# Altium schematic sheet breakout.SchDoc: Pin Breakout
size A4; SheetNumber: 6; SheetTotal: 6
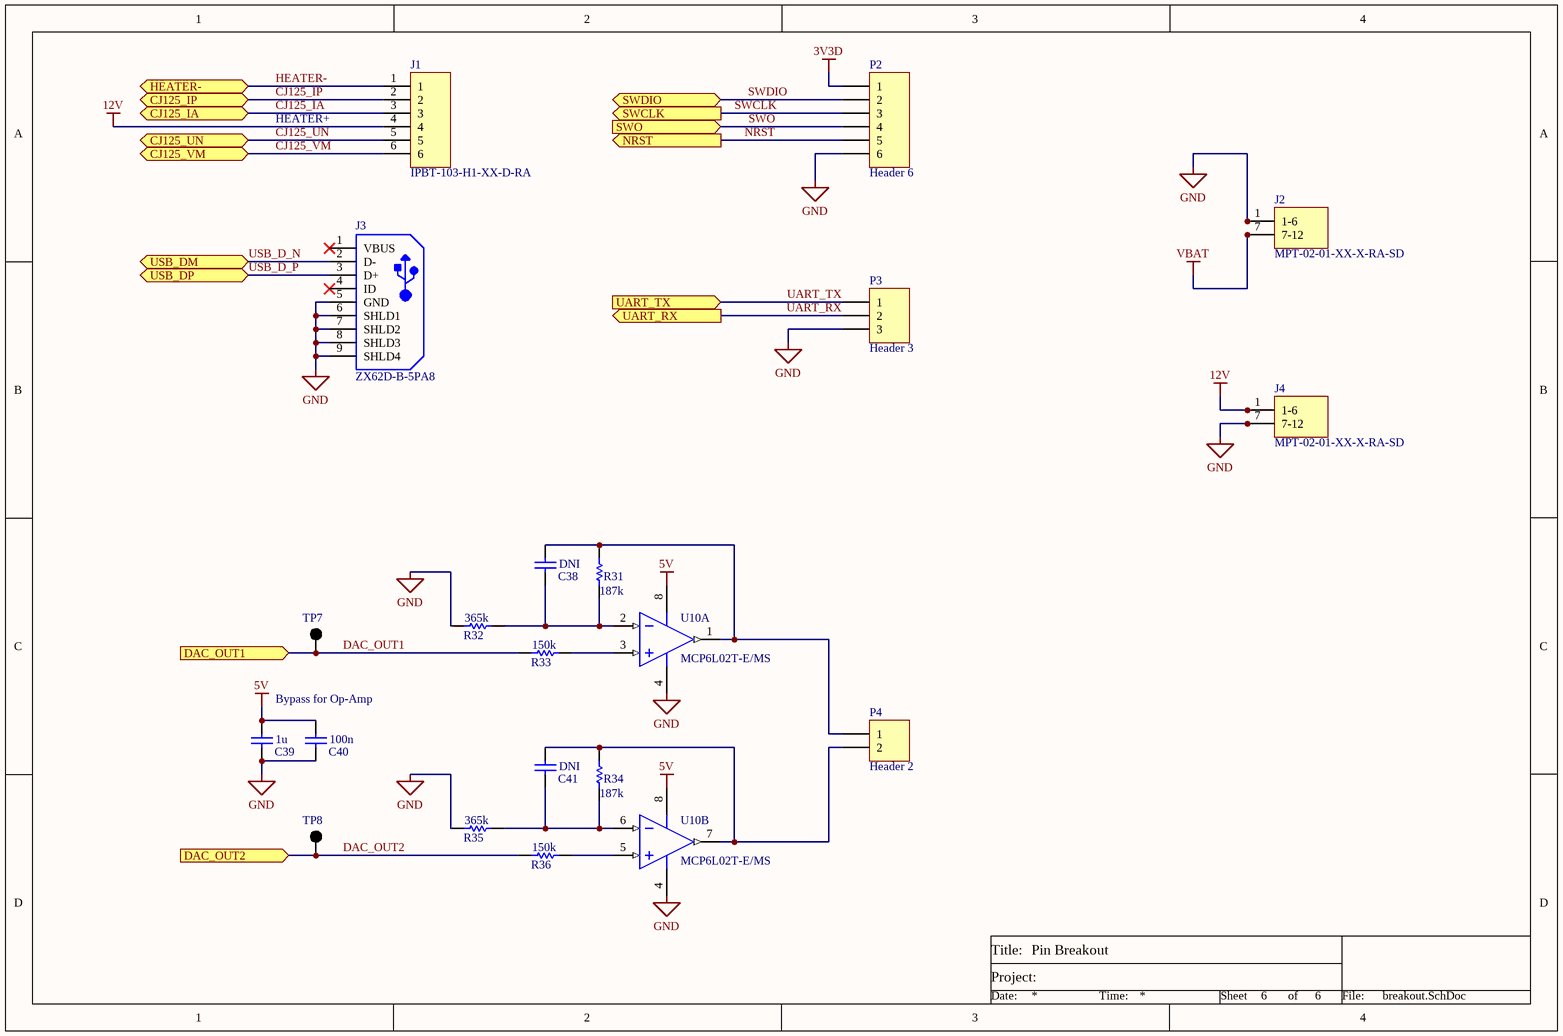
[diagram p0: breakout.SchDoc]

## Parts
C38  value DNI  [0805]  (hidden comment: Generic 0805 Capacitor)
C39  value 1u  [0805]  (hidden comment: Generic 0805 Capacitor)
C40  value 100n  [0805]  (hidden comment: Generic 0805 Capacitor)
C41  value DNI  [0805]  (hidden comment: Generic 0805 Capacitor)
J1  IPBT-103-H1-XX-D-RA  [IPBT-103-H1-XX-D-RA]
J2  MPT-02-01-XX-X-RA-SD  [MPT-02-01-XX-X-RA-SD]
J3  ZX62D-B-5PA8  [HIRO-ZX62D-B-5PA8_V]
J4  MPT-02-01-XX-X-RA-SD  [MPT-02-01-XX-X-RA-SD]
P2  Header 6  [HDR1X6]
P3  Header 3  [HDR1X3]
P4  Header 2  [HDR1X2]
R31  value 187k  [0603]  (hidden comment: Generic 0603 Resistor)
R32  value 365k  [0603]  (hidden comment: Generic 0603 Resistor)
R33  value 150k  [0603]  (hidden comment: Generic 0603 Resistor)
R34  value 187k  [0603]  (hidden comment: Generic 0603 Resistor)
R35  value 365k  [0603]  (hidden comment: Generic 0603 Resistor)
R36  value 150k  [0603]  (hidden comment: Generic 0603 Resistor)
TP7  5001  [KSTN-5001]  (value not drawn)
TP8  5001  [KSTN-5001]  (value not drawn)
U10  MCP6L02T-E/MS  [MSOP8_M]  (parts A,B of 2)

## Ports
CJ125_IA (bidir), CJ125_IP (bidir), CJ125_UN (bidir), CJ125_VM (bidir), DAC_OUT1 (in), DAC_OUT2 (in), HEATER- (bidir), NRST (out), SWCLK (out), SWDIO (bidir), SWO (in), UART_RX (out), UART_TX (in), USB_DM (bidir), USB_DP (bidir)

## Nets
3V3D: P2.1
5V: C39.2 C40.2 U10.8(VDD)
12V: J1.4 J4.1(1-6) J4.2 J4.3 J4.4 J4.5 J4.6
GND: C39.1 C40.1 J2.1(1-6) J2.2 J2.3 J2.4 J2.5 J2.6 J3.5(GND) J3.6(SHLD1) J3.7(SHLD2) J3.8(SHLD3) J3.9(SHLD4) J4.7(7-12) J4.8 J4.9 J4.10 J4.11 J4.12 P2.6 P3.3 R32.1 R35.1 U10.4(VSS)
VBAT: J2.7(7-12) J2.8 J2.9 J2.10 J2.11 J2.12
CJ125_IA: J1.3 ; port CJ125_IA
CJ125_IP: J1.2 ; port CJ125_IP
CJ125_UN: J1.5 ; port CJ125_UN
CJ125_VM: J1.6 ; port CJ125_VM
DAC_OUT1: R33.1 TP7.1 ; port DAC_OUT1
DAC_OUT2: R36.1 TP8.1 ; port DAC_OUT2
HEATER-: J1.1 ; port HEATER-
NRST: P2.5 ; port NRST
SWCLK: P2.3 ; port SWCLK
SWDIO: P2.2 ; port SWDIO
SWO: P2.4 ; port SWO
UART_RX: P3.2 ; port UART_RX
UART_TX: P3.1 ; port UART_TX
USB_D_N: J3.2(D-) ; port USB_DM
USB_D_P: J3.3(D+) ; port USB_DP
NetC38_1: C38.1 R31.1 R32.2 U10.2(VINA-)
NetC38_2: C38.2 P4.1 R31.2 U10.1(VOUTA)
NetC41_1: C41.1 R34.1 R35.2 U10.6(VINB-)
NetC41_2: C41.2 P4.2 R34.2 U10.7(VOUTB)
NetR33_2: R33.2 U10.3(VINA+)
NetR36_2: R36.2 U10.5(VINB+)

Not connected (* = marked no-connect by the designer): J3 1(VBUS)* 4(ID)*

## Notes on the sheet
- HEATER+
- Bypass for Op-Amp
- Title
- Title:
- Project:
- Size:
- Date:
- File:
- E
- Number:
- Time:
- Revision:
- Sheet
- of

## Library data of the parts
C38-C41 = C_0805: Specifications: *
J1 = IPBT-103-H1-XX-D-RA: 0.165 INCH DOUBLE ROW TERMINAL ASSEMBLY; ComponentLink1Description: Manufacturer URL; ComponentLink3Description: Package Specification; ComponentLink2URL: http://cds.linear.com/docs/en/datasheet/4356fa.pdf; ComponentLink3URL: http://cds.linear.com/docs/en/packaging/05081661_F_MS.pdf; ComponentLink1URL: http://www.linear.com/; ComponentLink2Description: Datasheet
J3 = Micro_USB: Micro-USB Connector Meeting USB 2.0 Standard, -30 to 85 degC, 5-Pin SMD, RoHS, Tape and Reel; Manufacturer: HiroseElectric; Number of Contacts: 5Contact; Current Rating: 1A; Brand: HiroseConnector; Number of Ports: 1Port; Voltage Rating: 30V; Mounting Angle: Right; Gender: Male; Connector Type: Receptacle; RoHS: Details; Package Reference: ZX62D-B-5PA8; Contact Plating: Gold; Product: MicroUSBTypeBConnectors; Shell Plating: Tin; Datasheet Version: 08/2010; Factory Pack Quantity: 2000; Manufacturer URL: https://www.hirose.com; Standard: USB2.0; Datasheet URL: https://datasheet.ciiva.com/22825/0900766b8118f7b1-22825836.pdf; Package Description: 5-Pin Surface Mount Device, Body 7.5 x 5 mm, Pitch 0.65 mm; Operating Temperature Range: -30Cto+85C; Series: ZX; Contact Material: CopperAlloy; Color: Black; Mounting Technology: SurfaceMount; Product Category: USBConnectors; Termination Style: Solder; Packaging: Reel
P2 = Header 6: Header, 6-Pin; LatestRevisionDate: 17-Jul-2002; LatestRevisionNote: Re-released for DXP Platform.; Publisher: Altium Limited
P3 = Header 3: Header, 3-Pin; LatestRevisionDate: 17-Jul-2002; LatestRevisionNote: Re-released for DXP Platform.; Publisher: Altium Limited
P4 = Header 2: Header, 2-Pin; LatestRevisionDate: 17-Jul-2002; LatestRevisionNote: Re-released for DXP Platform.; Publisher: Altium Limited
R31-R36 = R_0603: Specifications: *
TP7 TP8 = TP5001: Test Point, Black, 1-Pin THD, RoHS, Bulk; Manufacturer: Keystone; Other Names: 5001K; Catalog Drawings: 5000Series; Alternate Color: 5004K-ND / -TESTPOINTPCMINI.040"DYELLOW / 5003K-ND / -TESTPOINTPCMINI.040"DORANGE / 5002K-ND / -TESTPOINTPCMINI.040"DWHITE / 5000K-ND / -TESTPOINTPCMINI.040"DRED; Kits: DKTGRS232C-KIT-ND / -TTLCONVERTER; Online Catalog: ColorCodedTestPoints; Datasheet URL: https://ciiva.com/datasheet-click-2917627?src=ciiva&sig=bd195616; Mounting Type: 0.040"(1.02mm)HoleDiameter; Family: TestPoints; RoHS Information: RoHSComplianceStatement; Datasheet Version: Rev. G, 12/2008; Color: Black; Category: TestandMeasurement; Standard Package: 100; Manufacturer URL: http://www.keyelco.com/; Material: Base,Nylon46,UL94V-0; Type: PCTestPoint,Miniature; Terminal: 0.010"x0.020"(0.25mmx0.51mm)PhosphorBronzeWire,SilverPlated; Series: THM; Packaging: Bulk
U10 = MCP6L02: 1 MHz, 85 Î¼A Dual Op Amp, 8-Pin MSOP, Extended Temperature Range, Tape and Reel; ComponentLink2URL: http://ww1.microchip.com/downloads/en/DeviceDoc/22140b.pdf; PackageDescription: 8-Lead Plastic Micro Small Outline Package (MS) [MSOP]; ComponentLink1URL: http://www.microchip.com/; ComponentLink1Description: Manufacturer URL; RevisionNote: URLs added. DatasheetVersion updated.; PackageVersion: revBB, Aug-2009; ComponentLink3URL: http://www.microchip.com/stellent/groups/techpub_sg/documents/packagingspec/en012702.pdf; ComponentLink2Description: Datasheet; ComponentLink3Description: Package Specification; DatasheetVersion: revB, Sep-2011; PackageReference: MSOP-MS8
J2 J4 = MPT-02-01-XX-X-RA-SD: ComponentLink1Description: Manufacturer URL; ComponentLink3Description: Package Specification; ComponentLink2URL: http://cds.linear.com/docs/en/datasheet/4356fa.pdf; ComponentLink3URL: http://cds.linear.com/docs/en/packaging/05081661_F_MS.pdf; ComponentLink1URL: http://www.linear.com/; ComponentLink2Description: Datasheet